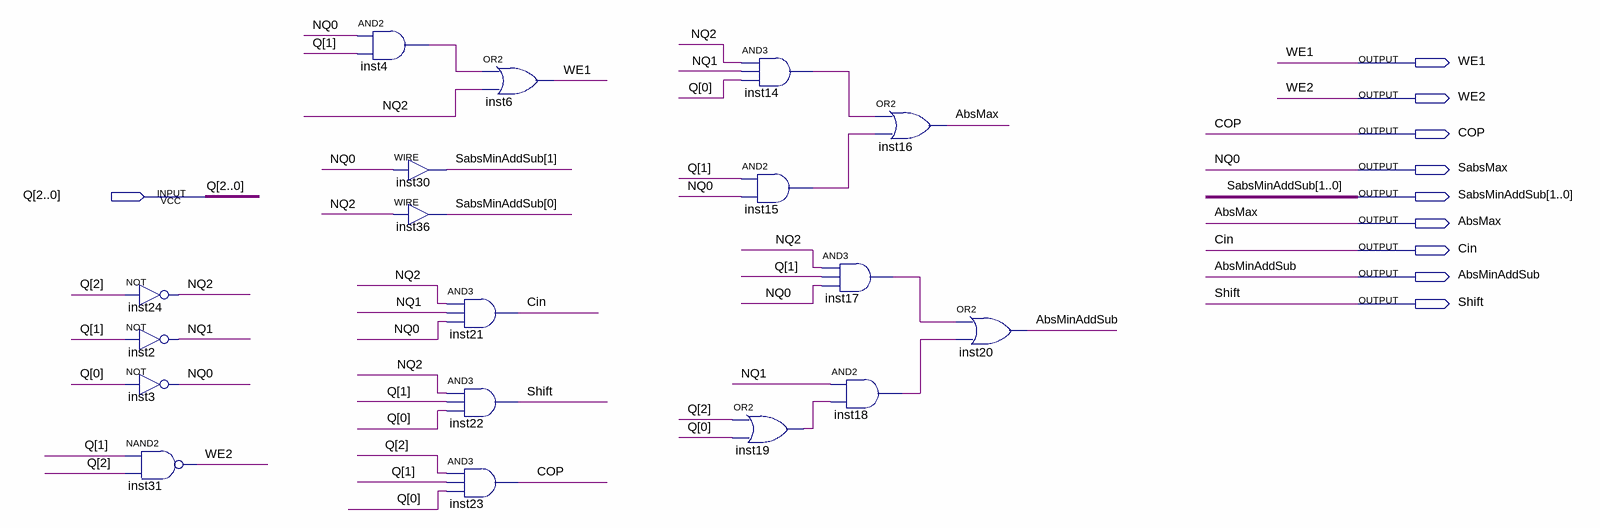
[diagram p0: schematic sheet]
// Quartus schematic OutputBlock.bdf as structural Verilog: 18 symbols, 10 pins
module OutputBlock (
  input  [2:0] Q,
  output WE1,
  output WE2,
  output COP,
  output SabsMax,
  output [1:0] SabsMinAddSub,
  output AbsMax,
  output Cin,
  output AbsMinAddSub,
  output Shift
);

  wire inst4_out, inst14_out, inst15_out, inst17_out, inst18_out, inst19_out, NQ1, NQ2;

  not inst24 (NQ2, Q[2]);
  not inst2 (NQ1, Q[1]);
  not inst3 (SabsMax, Q[0]);
  nand inst31 (WE2, Q[1], Q[2]);
  and inst4 (inst4_out, SabsMax, Q[1]);
  assign SabsMinAddSub[1] = SabsMax;  // WIRE inst30
  assign SabsMinAddSub[0] = NQ2;  // WIRE inst36
  or inst6 (WE1, inst4_out, NQ2);
  and inst21 (Cin, NQ2, NQ1, SabsMax);
  and inst22 (Shift, NQ2, Q[1], Q[0]);
  and inst23 (COP, Q[2], Q[1], Q[0]);
  and inst14 (inst14_out, NQ2, NQ1, Q[0]);
  and inst15 (inst15_out, Q[1], SabsMax);
  or inst19 (inst19_out, Q[2], Q[0]);
  and inst17 (inst17_out, NQ2, Q[1], SabsMax);
  and inst18 (inst18_out, NQ1, inst19_out);
  or inst16 (AbsMax, inst14_out, inst15_out);
  or inst20 (AbsMinAddSub, inst17_out, inst18_out);

  // Other names for the same wires on the sheet: NQ0 = SabsMax
endmodule
